# Altium project EGB220_SensorBoard.PrjPcb
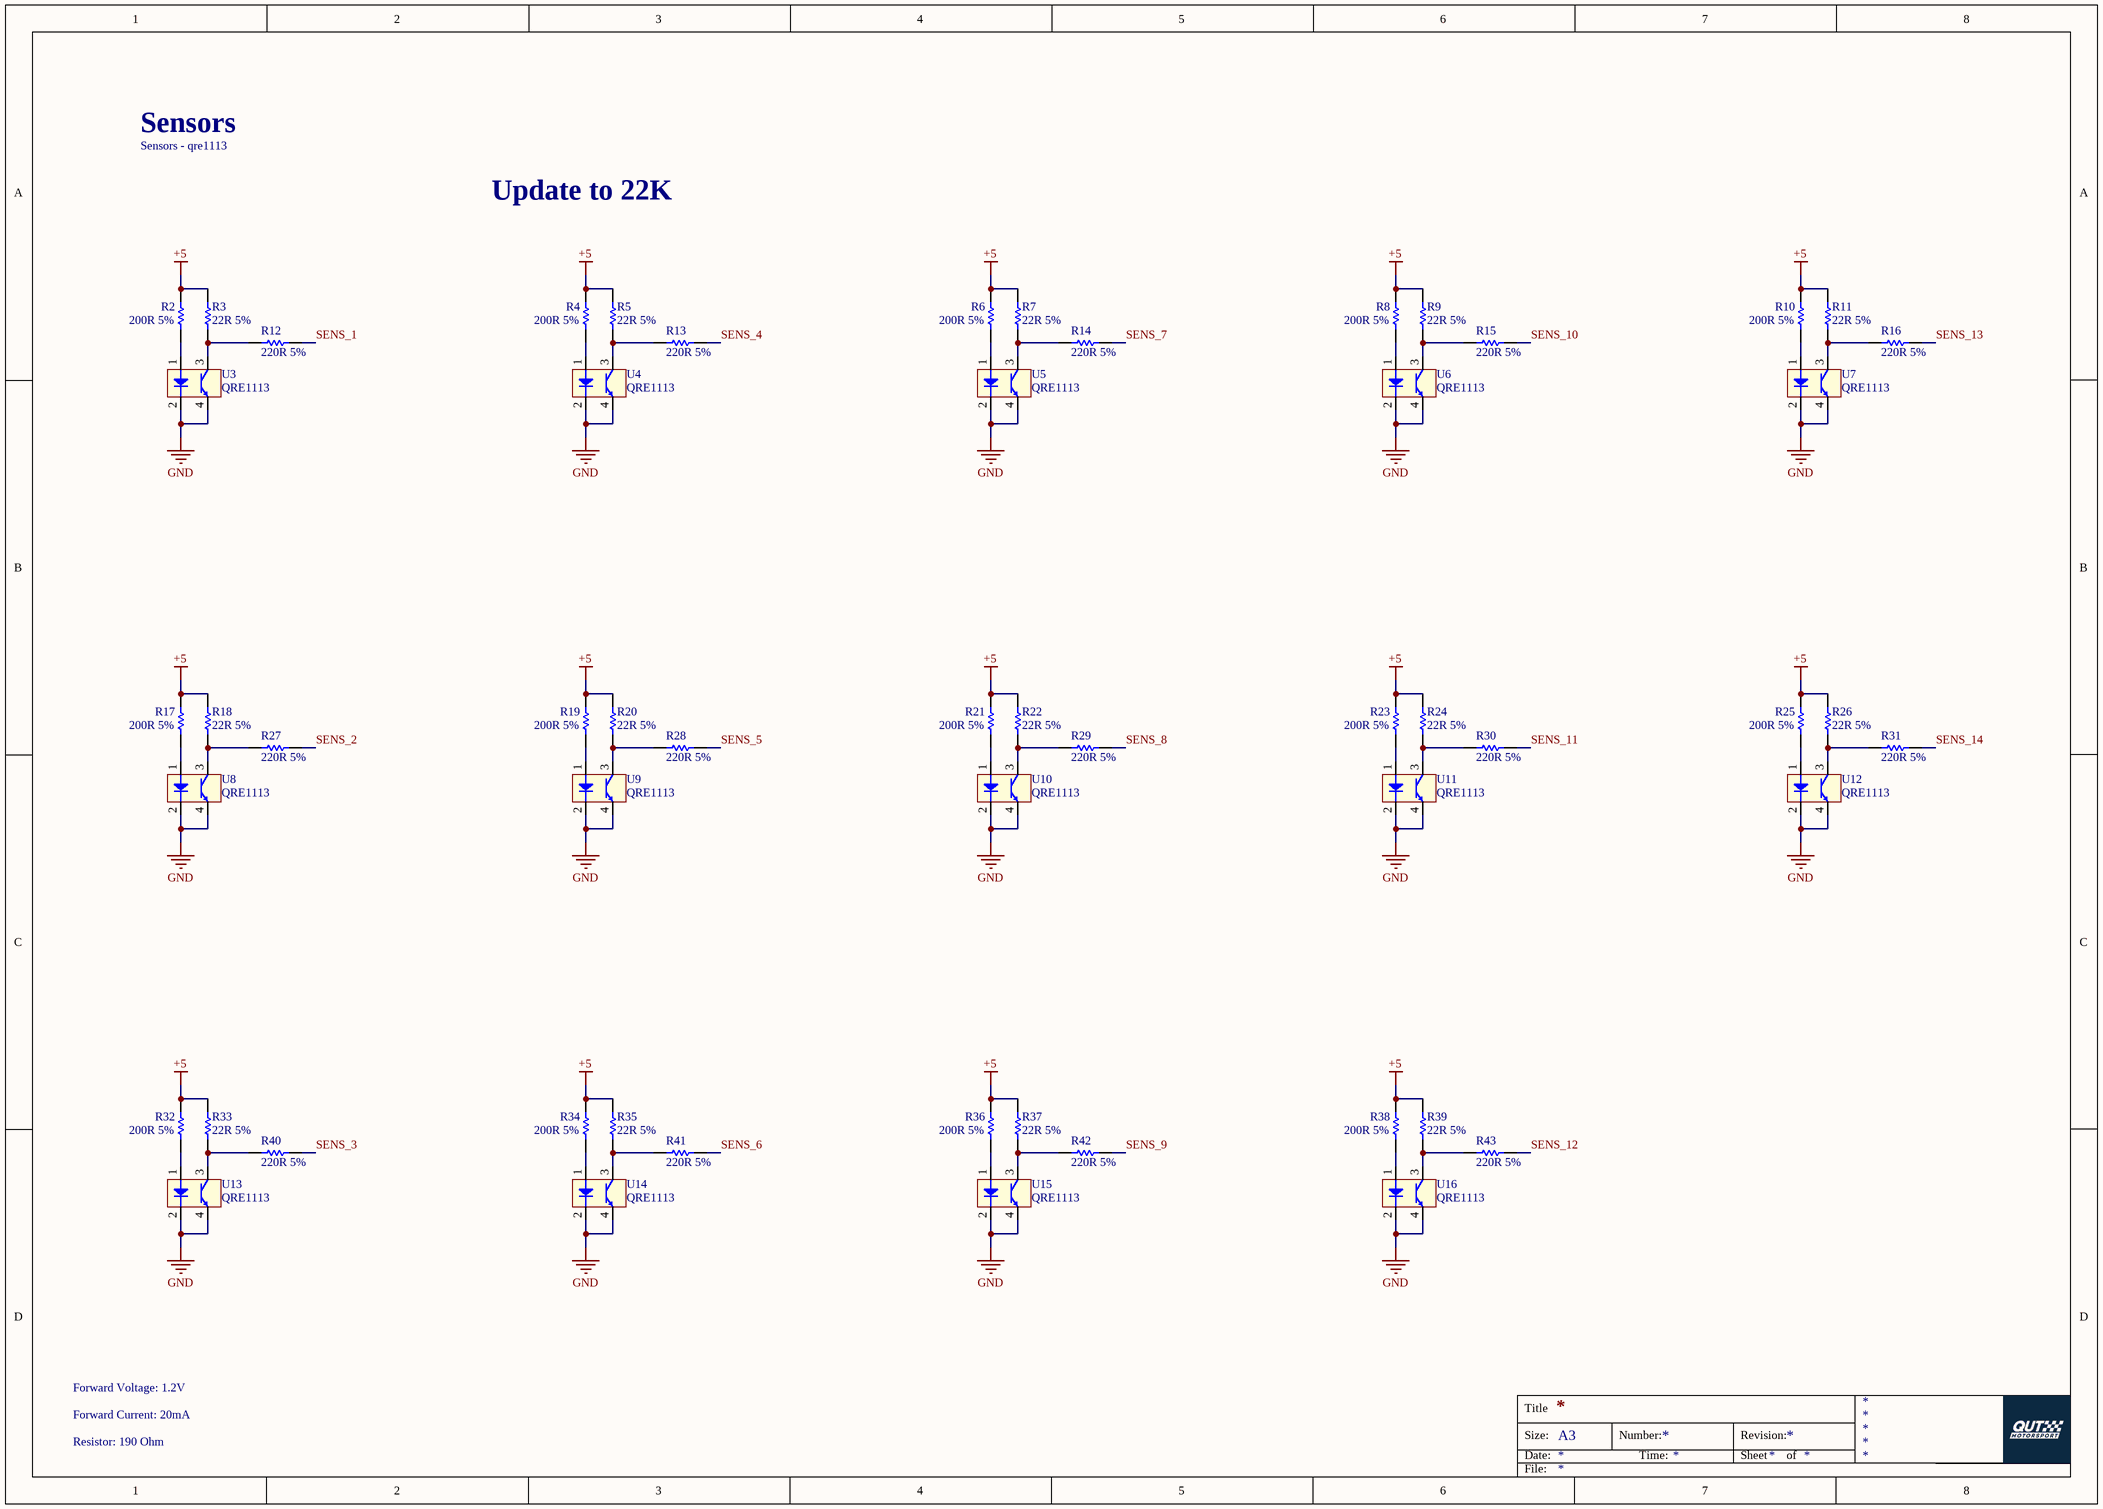
[diagram p0: Sensors.SchDoc]
2 sheets, 64 parts. Net scope: global (net labels, ports and power ports of the same name join across sheets).
Board file: Board.PcbDoc
Sheets:
  Sensors.SchDoc
  Control.SchDoc

## Sheet Sensors.SchDoc
size A3

### Parts
R2  200R 5%  [RESC0603(1608)_L]
R3  22R 5%  [RESC0603(1608)_N]
R4  200R 5%  [RESC0603(1608)_L]
R5  22R 5%  [RESC0603(1608)_N]
R6  200R 5%  [RESC0603(1608)_L]
R7  22R 5%  [RESC0603(1608)_N]
R8  200R 5%  [RESC0603(1608)_L]
R9  22R 5%  [RESC0603(1608)_N]
R10  200R 5%  [RESC0603(1608)_L]
R11  22R 5%  [RESC0603(1608)_N]
R12  220R 5%  [RESC0603(1608)_M]
R13  220R 5%  [RESC0603(1608)_M]
R14  220R 5%  [RESC0603(1608)_M]
R15  220R 5%  [RESC0603(1608)_M]
R16  220R 5%  [RESC0603(1608)_M]
R17  200R 5%  [RESC0603(1608)_L]
R18  22R 5%  [RESC0603(1608)_N]
R19  200R 5%  [RESC0603(1608)_L]
R20  22R 5%  [RESC0603(1608)_N]
R21  200R 5%  [RESC0603(1608)_L]
R22  22R 5%  [RESC0603(1608)_N]
R23  200R 5%  [RESC0603(1608)_L]
R24  22R 5%  [RESC0603(1608)_N]
R25  200R 5%  [RESC0603(1608)_L]
R26  22R 5%  [RESC0603(1608)_N]
R27  220R 5%  [RESC0603(1608)_M]
R28  220R 5%  [RESC0603(1608)_M]
R29  220R 5%  [RESC0603(1608)_M]
R30  220R 5%  [RESC0603(1608)_M]
R31  220R 5%  [RESC0603(1608)_M]
R32  200R 5%  [RESC0603(1608)_L]
R33  22R 5%  [RESC0603(1608)_N]
R34  200R 5%  [RESC0603(1608)_L]
R35  22R 5%  [RESC0603(1608)_N]
R36  200R 5%  [RESC0603(1608)_L]
R37  22R 5%  [RESC0603(1608)_N]
R38  200R 5%  [RESC0603(1608)_L]
R39  22R 5%  [RESC0603(1608)_N]
R40  220R 5%  [RESC0603(1608)_M]
R41  220R 5%  [RESC0603(1608)_M]
R42  220R 5%  [RESC0603(1608)_M]
R43  220R 5%  [RESC0603(1608)_M]
U3  QRE1113  [QRE1113GR]
U4  QRE1113  [QRE1113GR]
U5  QRE1113  [QRE1113GR]
U6  QRE1113  [QRE1113GR]
U7  QRE1113  [QRE1113GR]
U8  QRE1113  [QRE1113GR]
U9  QRE1113  [QRE1113GR]
U10  QRE1113  [QRE1113GR]
U11  QRE1113  [QRE1113GR]
U12  QRE1113  [QRE1113GR]
U13  QRE1113  [QRE1113GR]
U14  QRE1113  [QRE1113GR]
U15  QRE1113  [QRE1113GR]
U16  QRE1113  [QRE1113GR]

### Nets
+5: R2.2 R3.2 R4.2 R5.2 R6.2 R7.2 R8.2 R9.2 R10.2 R11.2 R17.2 R18.2 R19.2 R20.2 R21.2 R22.2 R23.2 R24.2 R25.2 R26.2 R32.2 R33.2 R34.2 R35.2 R36.2 R37.2 R38.2 R39.2
GND: U3.2 U3.4 U4.2 U4.4 U5.2 U5.4 U6.2 U6.4 U7.2 U7.4 U8.2 U8.4 U9.2 U9.4 U10.2 U10.4 U11.2 U11.4 U12.2 U12.4 U13.2 U13.4 U14.2 U14.4 U15.2 U15.4 U16.2 U16.4
SENS_1: R12.2
SENS_2: R27.2
SENS_3: R40.2
SENS_4: R13.2
SENS_5: R28.2
SENS_6: R41.2
SENS_7: R14.2
SENS_8: R29.2
SENS_9: R42.2
SENS_10: R15.2
SENS_11: R30.2
SENS_12: R43.2
SENS_13: R16.2
SENS_14: R31.2
NetR2_1: R2.1 U3.1
NetR3_1: R3.1 R12.1 U3.3
NetR4_1: R4.1 U4.1
NetR5_1: R5.1 R13.1 U4.3
NetR6_1: R6.1 U5.1
NetR7_1: R7.1 R14.1 U5.3
NetR8_1: R8.1 U6.1
NetR9_1: R9.1 R15.1 U6.3
NetR10_1: R10.1 U7.1
NetR11_1: R11.1 R16.1 U7.3
NetR17_1: R17.1 U8.1
NetR18_1: R18.1 R27.1 U8.3
NetR19_1: R19.1 U9.1
NetR20_1: R20.1 R28.1 U9.3
NetR21_1: R21.1 U10.1
NetR22_1: R22.1 R29.1 U10.3
NetR23_1: R23.1 U11.1
NetR24_1: R24.1 R30.1 U11.3
NetR25_1: R25.1 U12.1
NetR26_1: R26.1 R31.1 U12.3
NetR32_1: R32.1 U13.1
NetR33_1: R33.1 R40.1 U13.3
NetR34_1: R34.1 U14.1
NetR35_1: R35.1 R41.1 U14.3
NetR36_1: R36.1 U15.1
NetR37_1: R37.1 R42.1 U15.3
NetR38_1: R38.1 U16.1
NetR39_1: R39.1 R43.1 U16.3

### Notes on the sheet
- Sensors - qre1113
- Sensors
- Update to 22K
- Forward Voltage: 1.2V
- Forward Current: 20mA
- Resistor: 190 Ohm
- Title
- Size:
- Date:
- A3
- Number:
- Time:
- Revision:
- Sheet
- of
- File:

### Library data of the parts
R2 R4 R6 R8 R10 R17 R19 R21 R23 R25 R32 R34 R36 R38 = CMP-1012-00057-1: 200R 0.1W 5% 0603 (1608 Metric)  SMD; Case-EIA: 0603; Case-Metric: 1608; Value: 200.00 Ohm; Technology: SMT; Tolerance: 5 %; Power: 0.1 W
R3 R5 R7 R9 R11 R18 R20 R22 R24 R26 R33 R35 R37 R39 = CMP-1012-00034-1: 22R 0.1W 5% 0603 (1608 Metric)  SMD; Value: 22.00 Ohm; Case-EIA: 0603; Case-Metric: 1608; Technology: SMT; Power: 0.1 W; Tolerance: 5 %
R12-R16 R27-R31 R40-R43 = CMP-1012-00058-1: 220R 0.1W 5% 0603 (1608 Metric)  SMD; Case-EIA: 0603; Case-Metric: 1608; Value: 220.00 Ohm; Technology: SMT; Power: 0.1 W; Tolerance: 5 %

## Sheet Control.SchDoc
size A4
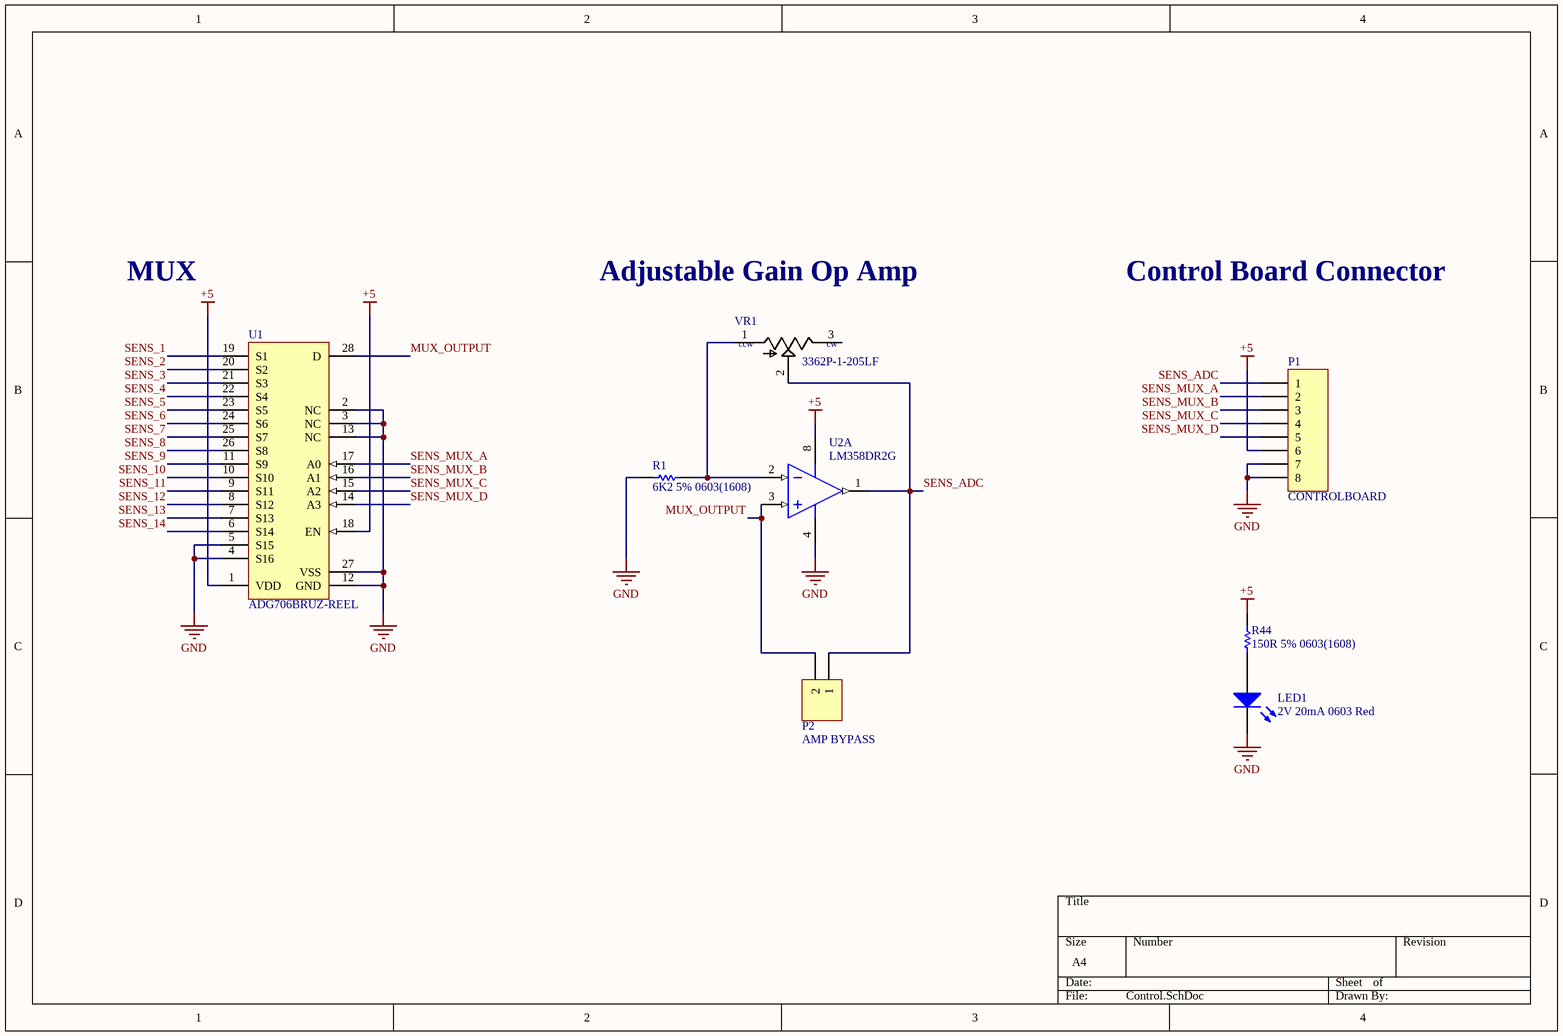
[diagram p1: Control.SchDoc]

### Parts
LED1  2V 20mA 0603 Red  [0603_A]
P1  CONTROLBOARD  [HDR1X8]
P2  AMP BYPASS  [HDR1X2]
R1  6K2 5% 0603(1608)  [RESC0603(1608)_L]
R44  150R 5% 0603(1608)  [RESC0603(1608)_L]
U1  ADG706BRUZ-REEL  [ADI-RU-28_M]
U2  LM358DR2G  [ONSC-SOIC-8-751-07_V]  (part A of 2)
VR1  3362P-1-205LF  [*TRIM_3362P-1-205LF]

### Nets
+5: P1.6 R44.2 U1.1(VDD) U1.18(EN) U2.8(VCC)
GND: LED1.1(K) P1.7 P1.8 R1.1 U1.2(NC) U1.3(NC) U1.4(S16) U1.5(S15) U1.12(GND) U1.13(NC) U1.27(VSS) U2.4(VEE/GND)
MUX_OUTPUT: P2.2 U1.28(D) U2.3(INA+)
SENS_1: U1.19(S1)
SENS_2: U1.20(S2)
SENS_3: U1.21(S3)
SENS_4: U1.22(S4)
SENS_5: U1.23(S5)
SENS_6: U1.24(S6)
SENS_7: U1.25(S7)
SENS_8: U1.26(S8)
SENS_9: U1.11(S9)
SENS_10: U1.10(S10)
SENS_11: U1.9(S11)
SENS_12: U1.8(S12)
SENS_13: U1.7(S13)
SENS_14: U1.6(S14)
SENS_ADC: P1.1 P2.1 U2.1(OUTA) VR1.2(WIPER)
SENS_MUX_A: P1.2 U1.17(A0)
SENS_MUX_B: P1.3 U1.16(A1)
SENS_MUX_C: P1.4 U1.15(A2)
SENS_MUX_D: P1.5 U1.14(A3)
NetLED1_2: LED1.2(A) R44.1
NetR1_2: R1.2 U2.2(INA-) VR1.1(CCW)

Not connected (* = marked no-connect by the designer): VR1 3(CW)

### Notes on the sheet
- MUX
- Adjustable Gain Op Amp
- Control Board Connector
- (in symbol 3362P-1-205LF) ccw; cw

### Library data of the parts
LED1 = CMP-1426-00001-1: SMD mono-color Chip LED, WL-SMCW, Red; Manufacturer: Wuerth Elektronik; PartNumber: 150060RS75000; Color: Red; PackageReference: 0603_A; ComponentLink2URL: http://katalog.we-online.com/led/datasheet/150060RS75000.pdf; ComponentLink1URL: http://www.we-online.com; ComponentLink1Description: Manufacturer URL; ComponentLink2Description: Datasheet
P1 = Header 8: Header, 8-Pin; System: Connector; LatestRevisionDate: 17-Jul-2002; LatestRevisionNote: Re-released for DXP Platform.; Publisher: Altium Limited
P2 = Header 2: Header, 2-Pin; LatestRevisionDate: 17-Jul-2002; LatestRevisionNote: Re-released for DXP Platform.; Publisher: Altium Limited
R1 = CMP-1012-00093-1: 6K2 0.1W 5% 0603 (1608 Metric)  SMD; Case-Metric: 1608; Value: 6200.00 Ohm; Case-EIA: 0603; Tolerance: 5 %; Power: 0.1 W; Technology: SMT
R44 = CMP-1012-00054-1: 150R 0.1W 5% 0603 (1608 Metric)  SMD; Case-EIA: 0603; Value: 150.00 Ohm; Case-Metric: 1608; Power: 0.1 W; Tolerance: 5 %; Technology: SMT
U1 = CMP-0798-00220-1: 1.8 to 5.5 V / 2.5 V, CMOS Low-Voltage 2.5 Ohm, 16-Channel Multiplexer, -40 to 85 degC, 28-pin SOP (RU-28), Reel; Manufacturer: Analog Devices; Supply V Guar Performance: Dual_(+/-2.5V), Single_(+3V), Single_(+5V); t transition (s): 40n; Bandwidth (Hz): 25M; Max Analog Signal Range: Vss to Vdd; Ron (ohms): 2.5; PackageDescription: 28-Pin Thin Shrink Small Outline Package, Body 9.7 x 4.4 mm, Pitch 0.65 mm; Mounting Technology: Surface Mount; ComponentLink2Description: Datasheet; Code_JEDEC: MO-153-AE; PackageReference: RU-28; ComponentLink2URL: http://www.analog.com/static/imported-files/data_sheets/ADG706_707.pdf; DatasheetVersion: Rev. A; PartNumber: ADG706BRUZ-REEL; ComponentLink3URL: http://www.analog.com/static/imported-files/packages/249854663RU_28.pdf; ComponentLink1Description: Manufacturer URL; ComponentLink3Description: Package Specification; ComponentLink1URL: http://www.analog.com/en/index.html; Packing: Reel; PackageVersion: Mar-05
U2 = CMP-1310-00291-1: Single Supply Dual Operational Amplifier, 3 to 32 V, 0 to 70 degC, 8-Pin SOIC, Pb-Free, Tape and Reel; Manufacturer: On Semiconductor; VCC Max (V): 32; VCC Min (V): 3; Packing: Tape and Reel; ComponentLink2Description: Datasheet; RoHS: TRUE; PackageDescription: 8-Pin Small Outline Integrated Circuit, Body 4.9 x 3.9 mm, Pitch 1.27 mm; PackageVersion: Rev. AK, 02/2011; ComponentLink1URL: http://www.onsemi.com/; ComponentLink1Description: Manufacturer URL; Mounting Technology: Surface Mount; ComponentLink3Description: Package Specification; ComponentLink3URL: http://www.onsemi.com/pub_link/Collateral/751-07.PDF; ComponentLink2URL: http://www.onsemi.cn/pub_link/Collateral/LM358-D.PDF; DatasheetVersion: Rev. 27; PackageReference: SOIC-8-751-07; PartNumber: LM358DR2G
VR1 = 3362P-1-205LF: Res Cermet Trimmer 2M Ohm 10% 1/2W 1_Elec_/1_Mech_Turn 2.77mm _6.6 X 6.99 X 4.7mm_ Pin Thru-Hole Tube; MF: Bourns; Package: 2220 Bourns; Price: None; MP: 3362P-1-205LF; Availability: Unavailable; SnapEDA_Link: https://www.snapeda.com/parts/3362P-1-205LF/Bourns%20-%20J.W.%20Miller/view-part/?ref=snap; Value: *

## Nets that join several sheets
+5: Sensors (28 pins), Control (5 pins)
GND: Sensors (28 pins), Control (12 pins)
SENS_1: Sensors (R12.2), Control (U1.19)
SENS_2: Sensors (R27.2), Control (U1.20)
SENS_3: Sensors (R40.2), Control (U1.21)
SENS_4: Sensors (R13.2), Control (U1.22)
SENS_5: Sensors (R28.2), Control (U1.23)
SENS_6: Sensors (R41.2), Control (U1.24)
SENS_7: Sensors (R14.2), Control (U1.25)
SENS_8: Sensors (R29.2), Control (U1.26)
SENS_9: Sensors (R42.2), Control (U1.11)
SENS_10: Sensors (R15.2), Control (U1.10)
SENS_11: Sensors (R30.2), Control (U1.9)
SENS_12: Sensors (R43.2), Control (U1.8)
SENS_13: Sensors (R16.2), Control (U1.7)
SENS_14: Sensors (R31.2), Control (U1.6)